# EAGLE design MBusUART (EAGLE 9.3.1)
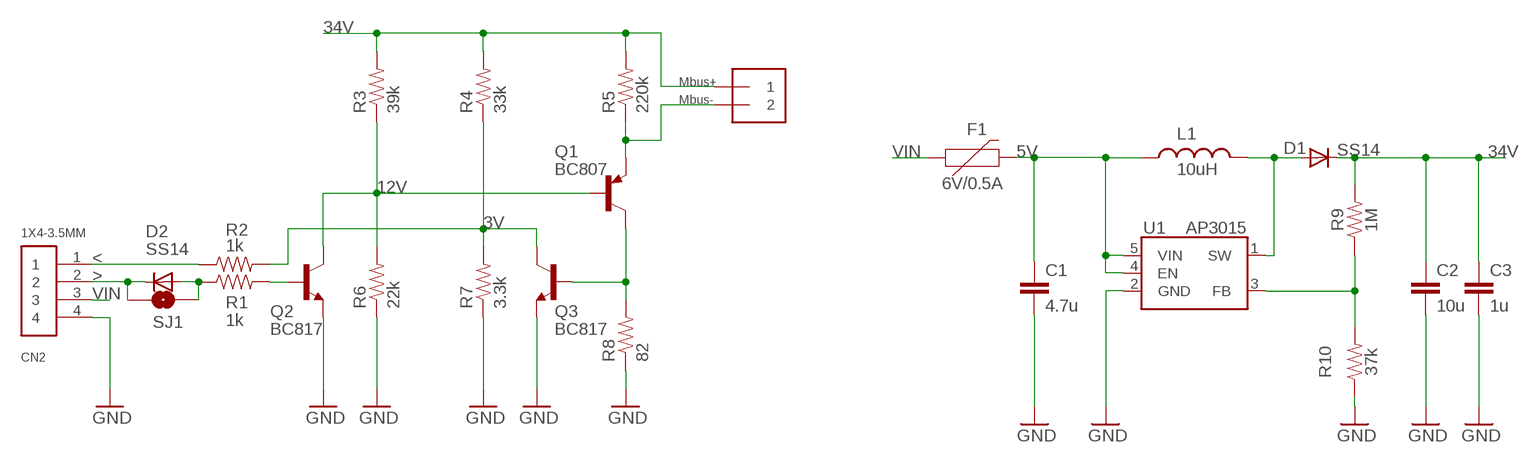
[diagram p0: schematic, sheet 1]

## Parts
C1  4.7u  1.0UF-0805-25V-(+80/-20%)  [0805]
C2  10u  1.0UF-1206-50V-10%  [1206]
C3  1u  1.0UF-1206-50V-10%  [1206]
CN2  1X4-3.5MM  [1X04-3.5MM]
D1  SS14  DIODESOD-123  [SOD-123]
D2  SS14  DIODESOD-123  [SOD-123]
F1  6V/0.5A  PPTC_HALF-AMP  [1206]
J1  1X2-3.5MM  [1X2-3.5MM]
L1  10uH  INDUCTORCR54  [CR54]
Q1  BC807  BC807-16-PNP-SOT23-BEC  [SOT23-BEC]
Q2  BC817  BC817-16SMD  [SOT23-BEC]
Q3  BC817  BC817-16SMD  [SOT23-BEC]
R1  1k  RESISTOR0805  [0805]
R2  1k  RESISTOR0805  [0805]
R3  39k  RESISTOR0805  [0805]
R4  33k  RESISTOR0805  [0805]
R5  220k  RESISTOR1206  [1206]
R6  22k  RESISTOR0805  [0805]
R7  3.3k  RESISTOR0805  [0805]
R8  82  RESISTOR1206  [1206]
R9  1M  RESISTOR0805  [0805]
R10  37k  RESISTOR0805  [0805]
SJ1  SOLDERJUMPERNO  [SJ_2S-NO]
U1  AP3015  [SOT-23-5]

## Nets
3V: Q3.C R2.2 R4.1 R7.2
5V: C1.1 F1.2 L1.P$1 U1.4(EN) U1.5(VIN)
12V: Q1.B Q2.C R3.1 R6.2
34V: C2.1 C3.1 D1.C J1.1 R3.2 R4.2 R5.2 R9.2
<: CN2.1 R2.1
>: CN2.2 D2.C SJ1.1
GND: C1.2 C2.2 C3.2 CN2.4 Q2.E Q3.E R6.1 R7.1 R8.1 R10.1 U1.2(GND)
MBUS-: J1.2 Q1.E R5.1
N$3: Q1.C Q3.B R8.2
N$4: R9.1 R10.2 U1.3(FB)
N$5: D1.A L1.P$2 U1.1(SW)
N$6: D2.A R1.1 SJ1.2
N$9: Q2.B R1.2
VIN: CN2.3 F1.1

## Notes on the sheet
- Mbus+
- Mbus-

## Library data of the parts
C1 = SparkFun-Capacitors:1.0UF: 1µF ceramic capacitors A capacitor is a passive two-terminal electrical component used to store electrical energy temporarily in an electric field.; PROD_ID: CAP-11625; VALUE: 1.0uF
C2 C3 = SparkFun-Capacitors:1.0UF: 1µF ceramic capacitors A capacitor is a passive two-terminal electrical component used to store electrical energy temporarily in an electric field.; PROD_ID: CAP-09822; VALUE: 1.0uF
CN2 = adafruit:1X4: 4-pin connector
D1 D2 = adafruit:DIODE: Diode SMADIODE - SMA Surface Mount Package 20V 1A Schottky Diode Digikey: 641-1014-6-ND DO-1N4148 - Through Hole Small Current Diode SOD-123 20V 1 A (.5mV Vf) Schottky Diode - Digikey: MBRX120TPMSCT-ND SOD-323 10V 570mA (.38mV Vf, 3ns) Schottky Diode - Digikey: ZLLS410CT-ND SOD-523 30V 30mA Schottky Diode (RB751S-40TE61) - Digikey: RB751S-40TE61CT-ND SOT23-R/W - SOT23 Package (R = Solder Paste/Reflow Ovens, W = Hand-Soldering) BAT54Film 40V 300mA - Digikey: 497-7162-1-ND
F1 = SparkFun-Fuses:PPTC: Resettable Fuse PPTC Resettable Fuse. Really a sort of resistor with a polymeric positive temperature coefficient whose resistance increases dramatically with an increase in temperature. When heated by the power passing through the resistance rises causing the current to be limited, protecting the circuit. This is achieved by the transition of the polymer from a crystalline to an amorphous state where the conductive carbon separates breaking the conductive pathways found in the cool crystalline structure. When a PPTC cools back down it resumes conducting letting the circuit turn back on. SparkFun Products: SparkFun RedBoard - Programmed with Arduino <https://www.sparkfun.com/products/12757> Pro Micro - 5V/16MHz <https://www.sparkfun.com/products/12640> Arduino Pro 328 - 5V/16MHz <https://www.sparkfun.com/products/10915> MP3 Trigger <https://www.sparkfun.com/products/13720>; PROD_ID: RES-08585
J1 = adafruit:1X2: 3.5mm Terminal block http://www.ladyada.net/library/pcb/eaglelibrary.html
L1 = SparkFun:INDUCTOR: Inductors Basic Inductor/Choke - 0603 and 1206. Footprints are not proven and vary greatly between part numbers.
Q1 = transistor:*-PNP-: PNP Transistror
Q2 Q3 = transistor-npn:BC817*: NPN Transistor
R1-R10 = SparkFun-Resistors:RESISTOR: Generic Resistor Package
SJ1 = SparkFun:SOLDERJUMPER: Solder Jumper Standard SMD solder jumper. Used to automate production. Two varients : Normally Open and Normally Closed are the same, but have different paste layers. NC will have a large amount of paste and should jumper during reflow.
U1 = dword1511-pmic-dcdc:AP3015: Micro-power Step-up DC-DC Converter

## Board
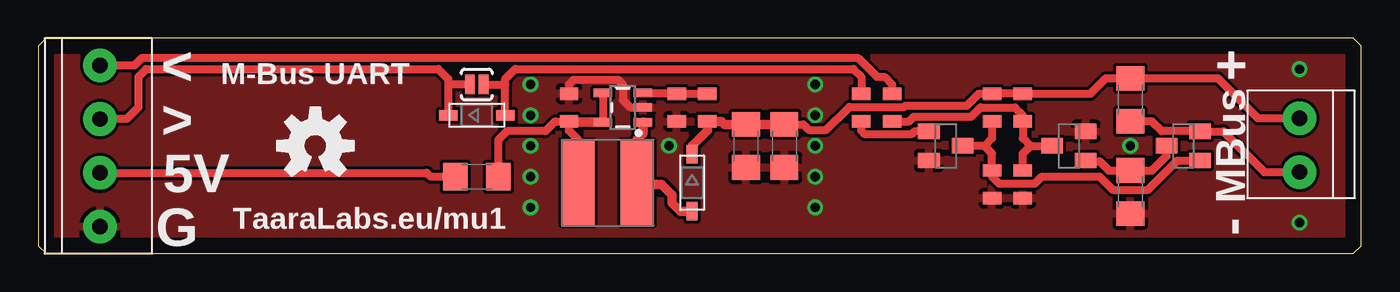
[diagram p1: board, top side]
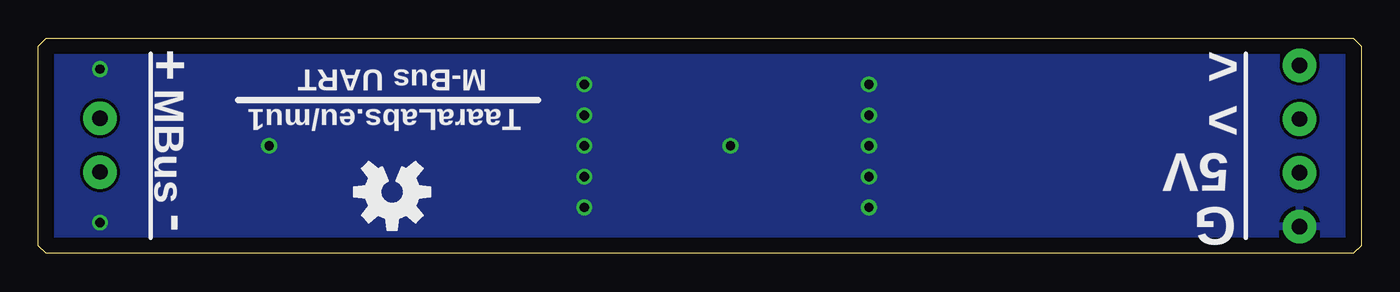
[diagram p2: board, bottom side, seen from below]

Size 86 x 14 mm. Coordinates in mm from the lower left corner, seen from the top.
Outline: 0,13.5 0,0.5 0.5,0 85.5,0 86,0.5 86,13.5 85.5,14 0.5,14 0,13.5
Copper layers (1*16): Top 0.035mm / dielectric 1.5mm / Bottom 0.035mm
Design rules "default": minimum track width 10mil, minimum drill 24mil, track to track 8mil, track to pad 8mil, pad to pad 8mil, via to via 8mil, smd to smd 8mil, copper to edge 40mil, drill to drill 8mil, minimum pad ring 10mil, minimum via ring 8mil, stop-mask expansion 4mil, vias tented up to drill 0mil, thermal gap 10mil

### Footprints (pad centres in the part's own frame; a part is rotated, then mirrored left to right if it is on the bottom)
0805 = smd 0.8 x 1.2: 1 -0.9,0; 2 0.9,0
1206 = smd 1.6 x 1.8: 1 -1.4,0; 2 1.4,0
1X04-3.5MM = drill 1 pad 2.184: 1 -5.25,0; 2 -1.75,0; 3 1.75,0; 4 5.25,0
SOD-123 = smd 1.2 x 0.7: A 1.85,0; C -1.85,0
1X2-3.5MM = drill 1 pad 2.184: 1 1.8,0; 2 -1.7,0
CR54 = smd 5.5 x 2.15: P$1 0,1.92; P$2 0,-1.92
SOT23-BEC = smd 1 x 1.4: B -0.95,-1.1; C 0,1.1; E 0.95,-1.1
SJ_2S-NO = smd 0.635 x 1.27: 1 -0.45,0; 2 0.45,0
SOT-23-5 = smd 0.55 x 1.2: 1 -0.95,-1.3; 2 0,-1.3; 3 0.95,-1.3; 4 0.95,1.3; 5 -0.95,1.3

### Placement (x,y rotation side)
C1  34.5,9.5 90 top
C2  46,7 270 top
C3  48.5,7 270 top
CN2  4,7 270 top
D1  42.5,4.6 270 top
D2  28.5,9 0 top
F1  28.5,5 0 top
J1  82,7 90 top
L1  37,4.6 90 top
Q1  74.44,7 90 top
Q2  59,7 270 top
Q3  67,7 90 top
R1  53.5,9.5 270 top
R2  55.5,9.5 270 top
R3  62,9.5 90 top
R4  64,9.5 90 top
R5  71,10 90 top
R6  62,4.5 90 top
R7  64,4.5 90 top
R8  71,4 90 top
R9  43.5,9.5 270 top
R10  41.5,9.5 90 top
SJ1  28.5,11 0 top
U1  38,9.5 90 top
U$1  [OSHW-LOGO-M]  18,7 0 top
U$2  [OSHW-LOGO-M]  63,4 180 bottom

### Tracks (layer width: path | path; a pad name or v marks a point on that pad's centre or on a via)
3V
  Top 0.508: 64.5,7 64,7.5 R4.1 64,9 63.5,9.5 61.25,9.5 60.66,8.91 56.91,8.91 56.61,8.6 R2.2 | 64.5,7 Q3.C | R7.2 64,6.5 64.5,7
5V
  Top 0.508: U1.4 U1.5 | F1.2 29.9,7.4 30.46,7.96 32.97,7.96 33.6,8.6 C1.1 34.5,8 35.08,7.42 L1.P$1
  Top 0.61: C1.1 34.55,8.55 U1.5
12V
  Top 0.508: R3.1 62,7.5 61.5,7 | 61.5,7 Q2.C | 61.5,7 62,6.5 R6.2 62,5 62.46,4.54 64.79,4.54 65.25,5 68.99,5 69.85,4.14 72.15,4.14 74.05,6.04 Q1.B
34V
  Top 0.508: J1.1 79.3,8.8 76.7,11.4 R5.2 69.4,11.4 68.4,10.4 R4.2 R3.2 61.15,10.4 60.37,9.62 56.37,9.62 56.29,9.54 52.73,9.54 51.22,8.04 50.1,8.04 49.73,8.4 C3.1
  Top 0.61: D1.C 42.5,7 43.5,8 R9.2 44.4,8.6 44.6,8.4 C2.1 C3.1
<
  Top 0.508: CN2.1 6.25,12.25 6.73,12.73 53.28,12.73 54.51,11.5 55,11.5 55.5,11 R2.1
>
  Top 0.508: CN2.2 5.75,8.75 6.5,9.5 6.5,11.5 6.54,11.54 7.01,12 26,12 26.65,11.35 26.65,11 | 26.65,11 D2.C | SJ1.1 26.65,11
GND  (via drill 0.61)
  Top 0.508: U1.2 38.5,9.5 38,10 38,11 37.71,11.29 34.79,11.29 34.5,11 C1.2
  other vias: 32,11 32,9 32,7 32,5 32,3 50.5,11 41,7 50.5,9 50.5,7 50.5,5 50.5,3 82,2 71,7 82,12
  pour Top: 0,14 86,14 86,0 0,0
  pour Top: 0,0 0,14 86,14 86,0
  pour Bottom: 0,14 86,14 86,0 0,0
MBUS-
  Top 0.508: J1.2 79.7,5.3 77.05,7.95 Q1.E 73.04,7.96 72.4,8.6 R5.1
N$3
  Top 0.508: Q3.B 68.15,6 69,6 69.6,5.4 R8.2 72.4,5.4 73.34,6.34 Q1.C
N$4
  Top 0.508: U1.3 41.4,10.45 R10.2 R9.1
N$5
  Top 0.61: U1.1 39.3,7.8 38.92,7.42 L1.P$2 39.02,4.5 40.5,4.5 41.2,3.8 41.2,3.3 41.75,2.75 D1.A
N$6
  Top 0.508: D2.A 30.35,11 | 30.35,11 30.35,11.35 31,12 53,12 53.5,11.5 R1.1 | SJ1.2 30.35,11
N$9
  Top 0.508: Q2.B 56.96,7.95 56.75,7.74 53.76,7.74 53.5,8 R1.2
VIN
  Top 0.508: CN2.3 25.25,5.25 25.5,5 F1.1

### Text on the board
tNames: < | + | M-Bus UART | > | MBus | 5V | TaaraLabs.eu/mu1 | G | -
bNames: > | M-Bus UART | + | < | TaaraLabs.eu/mu1 | MBus | 5V | G | -